# Altium schematic sheet [14] - CO-PROCESSOR.SchDoc: DOCUMENT TITLE
size A4; Organization: Bjørn T. Brodtkorb; Address1: Frode Rinnans veg 161; Address2: 7050 Trondheim; DocumentNumber: 6598; Revision: 1.0; SheetNumber: 1; SheetTotal: 1
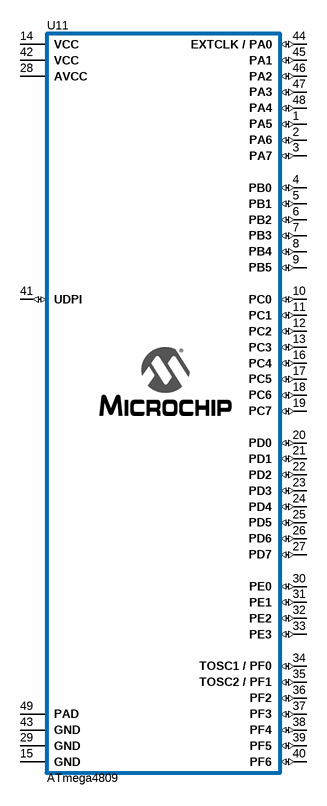
[diagram p0: [14] - CO-PROCESSOR.SchDoc]

## Parts
U11  ATmega4809  [ATMEGA4809-MFR]

## Nets

Not connected (* = marked no-connect by the designer): U11 1(PA5) 2(PA6) 3(PA7) 4(PB0) 5(PB1) 6(PB2) 7(PB3) 8(PB4) 9(PB5) 10(PC0) 11(PC1) 12(PC2) 13(PC3) 14(VCC) 15(GND) 16(PC4) 17(PC5) 18(PC6) 19(PC7) 20(PD0) 21(PD1) 22(PD2) 23(PD3) 24(PD4) 25(PD5) 26(PD6) 27(PD7) 28(AVCC) 29(GND) 30(PE0) 31(PE1) 32(PE2) 33(PE3) 34(TOSC1_/_PF0) 35(TOSC2_/_PF1) 36(PF2) 37(PF3) 38(PF4) 39(PF5) 40(PF6) 41(UDPI) 42(VCC) 43(GND) 44(EXTCLK_/_PA0) 45(PA1) 46(PA2) 47(PA3) 48(PA4) 49(PAD)

## Notes on the sheet
- Title
- Size:
- A4
- Number:
- Revision:
- Date:
- File:
- Time:
- Sheet
- of

## Library data of the parts
U11 = ATMEGA4809-MFR: ATmega4809 UQFN; Supplier Part Number 1: 2900707; Supplier 1: Farnell